# EAGLE design ECE411 V1.06 Final Draft Schematic (EAGLE 9.6.2)
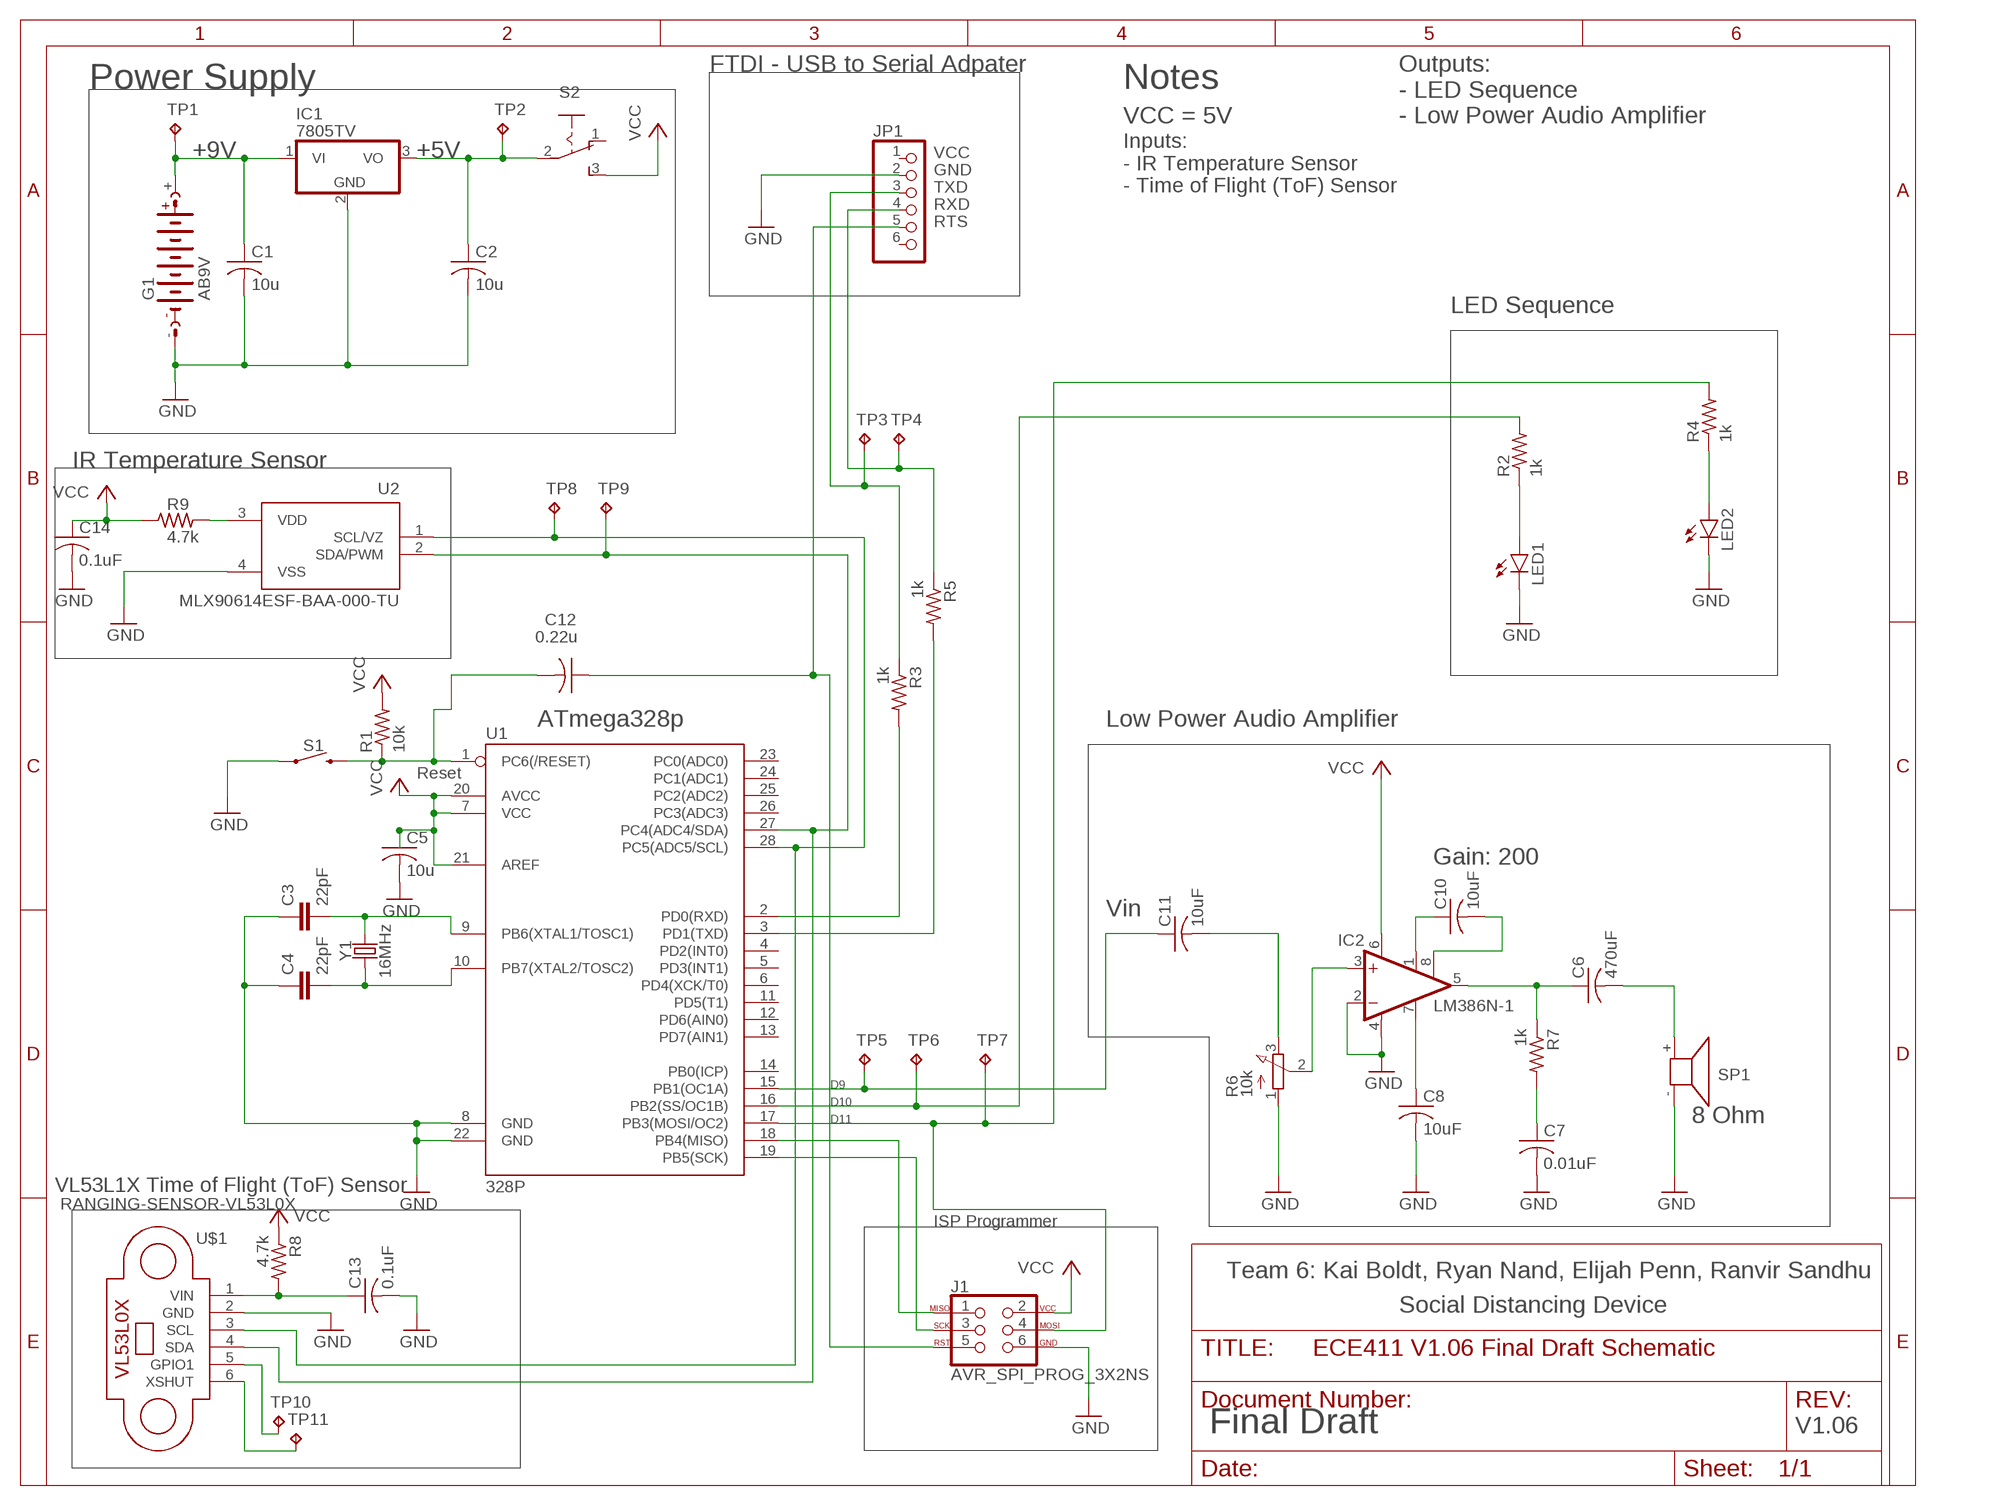
[diagram p0: schematic, sheet 1]

## Parts
C1  10u  C-US025-024X044  [C025-024X044]
C2  10u  C-US025-024X044  [C025-024X044]
C3  22pF  22PF-PTH-2.54MM-200V-5%  [CAP-PTH-2.54]
C4  22pF  22PF-PTH-2.54MM-200V-5%  [CAP-PTH-2.54]
C5  10u  C-US025-024X044  [C025-024X044]
C6  470uF  C-US050-024X044  [C050-024X044]
C7  0.01uF  C-US025-024X044  [C025-024X044]
C8  10uF  C-US025-024X044  [C025-024X044]
C10  10uF  C-US025-024X044  [C025-024X044]
C11  10uF  C-US025-024X044  [C025-024X044]
C12  0.22u  C-US050-030X075  [C050-030X075]
C13  0.1uF  C-US025-024X044  [C025-024X044]
C14  0.1uF  C-US025-024X044  [C025-024X044]
G1  AB9V  [AB9V]
IC1  7805TV  [TO220V]
IC2  LM386N-1  [DIL08]
J1  AVR_SPI_PROG_3X2NS  [2X3-NS]
JP1  PINHD-1X6  [1X06]
LED1  LED3MM  [LED3MM]
LED2  LED3MM  [LED3MM]
R1  10k  R-US_0204/7  [0204/7]
R2  1k  R-US_0204/5  [0204/5]
R3  1k  R-US_0204/7  [0204/7]
R4  1k  R-US_0204/5  [0204/5]
R5  1k  R-US_0204/7  [0204/7]
R6  10k  3RP/1610N  [3RP/1610N]
R7  1k  R-US_0204/7  [0204/7]
R8  4.7k  R-US_0204/7  [0204/7]
R9  4.7k  R-US_0204/7  [0204/7]
S1  MOMENTARY-SWITCH-SPST-PTH-6.0MM  [TACTILE_SWITCH_PTH_6.0MM]
S2  255SB  [255SB]
SP1  KSS1201  [KSS1201]
TP1  TPPAD1-13  [P1-13]
TP2  TPPAD1-13  [P1-13]
TP3  TPPAD1-13  [P1-13]
TP4  TPPAD1-13  [P1-13]
TP5  TPPAD1-13  [P1-13]
TP6  TPPAD1-13  [P1-13]
TP7  TPPAD1-13  [P1-13]
TP8  TPPAD1-13  [P1-13]
TP9  TPPAD1-13  [P1-13]
TP10  TPPAD1-13  [P1-13]
TP11  TPPAD1-13  [P1-13]
U1  328P  ATMEGA328P_PDIP  [DIP28]
U2  MLX90614ESF-BAA-000-TU  [TO254P942H425-4]
U$1  RANGING-SENSOR-VL53L0X  [RANGING-SENSOR-VL53L0X]
Y1  16MHz  CRYSTAL-16MHZPTH-HC49US  [HC49US]

## Nets
5V: C2.1 IC1.3(VO) S2.2(P) TP2.TP
+9V: C1.1 G1.+ IC1.1(VI) TP1.TP
AUDIO: C11.1 TP5.TP U1.15(PB1(OC1A))
BYPASS: C8.1 IC2.7(BYPASS)
GAIN: C10.1 IC2.1(GAIN)
GND: C1.2 C2.2 C3.1 C4.1 C5.2 C7.2 C8.2 C13.2 C14.2 G1.- IC1.2(GND) IC2.2(-IN) IC2.4(GND) J1.6 JP1.2 LED1.K(C) LED2.K(C) R6.1(A) S1.1 SP1.- U1.8(GND) U1.22(GND) U2.4(VSS) U$1.2(GND)
GPIO1: TP10.TP U$1.5(GPIO1)
INPUT: IC2.3(+IN) R6.2(S)
LED1: R2.2 TP6.TP U1.16(PB2(SS/OC1B))
LED2: J1.4 R4.2 TP7.TP U1.17(PB3(MOSI/OC2))
N$1: C3.2 U1.9(PB6(XTAL1/TOSC1)) Y1.2
N$2: J1.1 U1.18(PB4(MISO))
N$3: C4.2 U1.10(PB7(XTAL2/TOSC2)) Y1.1
N$6: J1.3 U1.19(PB5(SCK))
N$7: C7.1 R7.2
N$10: C10.2 IC2.8(GAIN)
N$13: C11.2 R6.3(E)
N$21: LED1.A R2.1
N$22: LED2.A R4.1
RESET: C12.2 R1.1 S1.3 U1.1(PC6(/RESET))
RTS: C12.1 J1.5 JP1.5
RXD: JP1.4 R5.1 R5.2 TP4.TP U1.3(PD1(TXD))
SCL: TP8.TP U1.28(PC5(ADC5/SCL)) U2.1(SCL/VZ) U$1.3(SCL)
SDA: TP9.TP U1.27(PC4(ADC4/SDA)) U2.2(SDA/PWM) U$1.4(SDA)
TXD: JP1.3 R3.1 R3.2 TP3.TP U1.2(PD0(RXD))
VCC: C5.1 C13.1 C14.1 IC2.6(VS) J1.2 R1.2 R8.1 R8.2 R9.1 R9.2 S2.3(S) U1.7(VCC) U1.20(AVCC) U1.21(AREF) U2.3(VDD) U$1.1(VIN)
VO: C6.2 SP1.+
VOUT: C6.1 IC2.5(OUT) R7.1
XSHUT: TP11.TP U$1.6(XSHUT)
Unconnected: JP1.1 JP1.6 S2.1(O) U1.4(PD2(INT0)) U1.5(PD3(INT1)) U1.6(PD4(XCK/T0)) U1.11(PD5(T1)) U1.12(PD6(AIN0)) U1.13(PD7(AIN1)) U1.14(PB0(ICP)) U1.23(PC0(ADC0)) U1.24(PC1(ADC1)) U1.25(PC2(ADC2)) U1.26(PC3(ADC3))

## Notes on the sheet
- FTDI - USB to Serial Adpater
- Power Supply | Notes
- VCC = 5V
- Outputs:
  - LED Sequence
  - Low Power Audio Amplifier
- +5V | VCC
- GND
- TXD
- Inputs:
  - IR Temperature Sensor
  - Time of Flight (ToF) Sensor
- RXD
- RTS
- LED Sequence
- IR Temperature Sensor
- ATmega328p | Low Power Audio Amplifier
- Reset
- Gain: 200
- Vin
- D9
- D10
- D11 | 8 Ohm
- VL53L1X Time of Flight (ToF) Sensor
- ISP Programmer
- Team 6: Kai Boldt, Ryan Nand, Elijah Penn, Ranvir Sandhu
- Social Distancing Device
- Final Draft | V1.06

## Library data of the parts
C1 C2 C5-C8 C10-C14 = rcl:C-US: CAPACITOR, American symbol; SPICEPREFIX: C
C3 C4 = SparkFun-Capacitors:22PF: 22pF ceramic capacitors A capacitor is a passive two-terminal electrical component used to store electrical energy temporarily in an electric field.; PROD_ID: CAP-09128
G1 = battery:AB9V: 9-V BATTERY CLIP
IC1 = linear:78*: Positive VOLTAGE REGULATOR Source: http://cache.national.com/ds/LM/LM78L05.pdf http://www.fairchildsemi.com/ds/LM/LM7805.pdf
IC2 = linear:LM386?-*: Low Voltage Audio Power Amplifier Source: http://cache.national.com/ds/LM/LM386.pdf
J1 = SparkFun-Connectors:AVR_SPI_PROG_3X2: AVR ISP 6 Pin This is the reduced ISP connector for AVR programming. Common on Arduino. This footprint will take up less PCB space and can be used with a 10-pin to 6-pin adapter such as SKU: BOB-08508 **Special note about "TEST_POINT" package. The stop mask is on the top side, so if you want your programming test points to be on the bottom of your board, make sure to place this package on the bottom side of the board. This also ensure that the orientation to program from the bottom side will be correct. SparkFun Products: SparkFun ISP Pogo Adapter <https://www.sparkfun.com/products/11591> - NS Tiny AVR Programmer <https://www.sparkfun.com/products/11801> -PTH
JP1 = pinhead:PINHD-1X6: PIN HEADER
LED1 LED2 = led:LED: LED OSRAM: - CHIPLED LG R971, LG N971, LY N971, LG Q971, LY Q971, LO R971, LY R971 LH N974, LH R974 LS Q976, LO Q976, LY Q976 LO Q996 - Hyper CHIPLED LW Q18S LB Q993, LB Q99A, LB R99A - SideLED LS A670, LO A670, LY A670, LG A670, LP A670 LB A673, LV A673, LT A673, LW A673 LH A674 LY A675 LS A676, LA A676, LO A676, LY A676, LW A676 LS A679, LY A679, LG A679 - Hyper Micro SIDELED® LS Y876, LA Y876, LO Y876, LY Y876 LT Y87S - SmartLED LW L88C, LW L88S LB L89C, LB L89S, LG L890 LS L89K, LO L89K, LY L89K LS L896, LA L896, LO L896, LY L896 - TOPLED LS T670, LO T670, LY T670, LG T670, LP T670 LSG T670, LSP T670, LSY T670, LOP T670, LYG T670 LG T671, LOG T671, LSG T671 LB T673, LV T673, LT T673, LW T673 LH T674 LS T676, LA T676, LO T676, LY T676, LB T676, LH T676, LSB T676, LW T676 LB T67C, LV T67C, LT T67C, LS T67K, LO T67K, LY T67K, LW E67C LS E67B, LA E67B, LO E67B, LY E67B, LB E67C, LV E67C, LT E67C LW T67C LS T679, LY T679, LG T679 LS T770, LO T770, LY T770, LG T770, LP T770 LB T773, LV T773, LT T773, LW T773 LH T774 LS E675, LA E675, LY E675, LS T675 LS T776, LA T776, LO T776, LY T776, LB T776 LHGB T686 LT T68C, LB T68C - Hyper Mini TOPLED® LB M676 - Mini TOPLED Santana® LG M470 LS M47K, LO M47K, LY M47K Source: http://www.osram.convergy.de LUXEON: - LUMILED® LXK2-PW12-R00, LXK2-PW12-S00, LXK2-PW14-U00, LXK2-PW14-V00 LXK2-PM12-R00, LXK2-PM12-S00, LXK2-PM14-U00 LXK2-PE12-Q00, LXK2-PE12-R00, LXK2-PE12-S00, LXK2-PE14-T00, LXK2-PE14-U00 LXK2-PB12-K00, LXK2-PB12-L00, LXK2-PB12-M00, LXK2-PB14-N00, LXK2-PB14-P00, LXK2-PB14-Q00 LXK2-PR12-L00, LXK2-PR12-M00, LXK2-PR14-Q00, LXK2-PR14-R00 LXK2-PD12-Q00, LXK2-PD12-R00, LXK2-PD12-S00 LXK2-PH12-R00, LXK2-PH12-S00 LXK2-PL12-P00, LXK2-PL12-Q00, LXK2-PL12-R00 Source: www.luxeon.com KINGBRIGHT: KA-3528ASYC Source: www.kingbright.com
R1-R5 R7-R9 = rcl:R-US_: RESISTOR, American symbol; SPICEPREFIX: R
R6 = pot:3RP/1610N: 16mm Potentiometer one level Source: http://www.alphapotentiometers.net/html/16mm_pot_2.html
S1 = SparkFun-Switches:MOMENTARY-SWITCH-SPST: Momentary Switch (Pushbutton) - SPST Normally-open (NO) SPST momentary switches (buttons, pushbuttons). Variants PTH-12MM - 12mm square, through-hole Momentary Pushbutton Switch - 12mm Square <https://www.sparkfun.com/products/9190> (COM-09190) PTH-6.0MM, PTH-6.0MM-KIT - 6.0mm square, through-hole Mini Pushbutton Switch <https://www.sparkfun.com/products/97> (COM-00097) KIT package intended for soldering kit's - only one side of pads' copper is exposed. PTH-RIGHT-ANGLE-KIT - Right-angle, through-hole Right Angle Tactile Button <https://www.sparkfun.com/products/10791> - Used on SparkFun BigTime Watch Kit <https://www.sparkfun.com/products/11734> SMD-12MM - 12mm square, surface-mount Tactile Button - SMD (12mm) <https://www.sparkfun.com/products/12993> (COM-12993) Used on SparkFun PicoBoard <https://www.sparkfun.com/products/11888> SMD-4.5MM - 4.5mm Square Trackball Switch Used on SparkFun Blackberry Trackballer Breakout <https://www.sparkfun.com/products/13169> SMD-4.6MMX2.8MM - 4.60mm x 2.80mm, surface mount Used on SparkFun SAMD21 Mini Breakout <https://www.sparkfun.com/products/13664> SMD-5.2MM, SMD-5.2-REDUNDANT - 5.2mm square, surface-mount Mini Pushbutton Switch - SMD <https://www.sparkfun.com/products/8720> (COM-08720) Used on Arduino Pro Mini <https://www.sparkfun.com/products/11114> REDUNDANT package connects both switch circuits together SMD-6.0X3.5MM - 6.0 x 3.5mm, surface mount Momentary Reset Switch SMD <https://www.sparkfun.com/products/8229> (COM-08229) SMD-6.2MM-TALL - 6.2mm square, surface mount Tactile Button - SMD (6mm) <https://www.sparkfun.com/products/12992> Used on SparkFun Digital Sandbox <https://www.sparkfun.com/products/12651> SMD-RIGHT-ANGLE - Right-angle, surface mount Used on SparkFun Block for Intel® Edison - Arduino <https://www.sparkfun.com/products/13036>; PROD_ID: SWCH-08441; SF_SKU: COM-00097
S2 = switch:255SB: SLIDING SWITCH Distributor Buerklin, 11G810
SP1 = buzzer:KSS1201: SPEAKER Source: Schukat; OC_FARNELL: unknown; OC_NEWARK: unknown
TP1-TP11 = testpad:TP: Test pad
U1 = SparkFun-IC-Microcontroller:ATMEGA328P_PDIP: Atmel 328P Through hole ATMEGA328P uC used in the Arduino 32kb flash, 1k EEPROM, 2k SRAM Datasheet <http://www.sparkfun.com/datasheets/Components/SMD/ATMega328.pdf> SparkFun Products Storefront component: AVR 28 Pin 20MHz 32K 6A/D - ATMega328P <https://www.sparkfun.com/products/9061> (COM-09061) SparkFun Simon Says - Through-Hole Soldering Kit <https://www.sparkfun.com/products/10547> (KIT-10547) SparkFun Learn to Solder - Simon Says <https://www.sparkfun.com/products/13708> (KIT-13708) SparkFun BigTime Watch Kit <https://www.sparkfun.com/products/11734> (KIT-11734) SparkFun ClockIt <https://www.sparkfun.com/products/10930> (KIT-10930) SparkFun Serial Enabled LCD Kit <https://www.sparkfun.com/products/10097> (LCD-10097) SparkFun Simon Tilts - Through Hole Soldering Kit <https://www.sparkfun.com/products/12634> (KIT-12634) SparkFun Frequency Counter Kit <https://www.sparkfun.com/products/10140> (KIT-10140) FabFM Radio Kit <https://www.sparkfun.com/products/11043> (KIT-11043) SparkFun Binary Blaster Kit <https://www.sparkfun.com/products/12037> (KIT-12037) SparkFun Metro-Gnome <https://www.sparkfun.com/products/9236> (KIT-09236) ATmega328 with Arduino Optiboot (Uno) <https://www.sparkfun.com/products/10524> (DEV-10524); PROD_ID: IC-09136
U2 = MLX90614ESF-BAA-000-TU:MLX90614ESF-BAA-000-TU: Temperature Sensor Digital, Infrared (IR) -40°C ~ 85°C 16 b TO-39 Check prices <https://pricing.snapeda.com/parts/MLX90614ESF-BAA-000-TU/Melexis/view-part?ref=eda>; AVAILABILITY: Warning; DESCRIPTION: Temperature Sensor Digital, Infrared (IR) -40°C ~ 85°C 16 b TO-39; MF: Melexis; MP: MLX90614ESF-BAA-000-TU; PACKAGE: TO-39 Melexis; PRICE: None; PURCHASE-URL: https://pricing.snapeda.com/search/part/MLX90614ESF-BAA-000-TU/?ref=eda
U$1 = VL53L0X:RANGING-SENSOR-VL53L0X: Laser Ranging Sensor based on VL53L0X device More information about VL53L0X device can be found here: http://www.st.com/en/imaging-and-photonics-solutions/vl53l0x.html Arduino Library for VL53L0X is available here: https://github.com/pololu/vl53l0x-arduino Click here to find device on ebay.com <http://www.ebay.com/sch/GY+VL53L0X+module> Note: There are many variants. Search for the proper version.
Y1 = SparkFun-Clocks:CRYSTAL-16MHZ: 16MHz Crystal Digikey Example <http://www.digikey.com/product-search/en?keywords=535-9122-1-ND> Frequency: 16MHz Frequency Stability: ±50ppm Frequency Tolerance: ±20ppm Load Capacitance: 18pF SparkFun Products: Pro Micro -5V/16MHz <https://www.sparkfun.com/products/12640> SparkFun Serial Enabled LCD Kit <https://www.sparkfun.com/products/10097>; PROD_ID: XTAL-08181; SF_ID: COM-00536

## Board
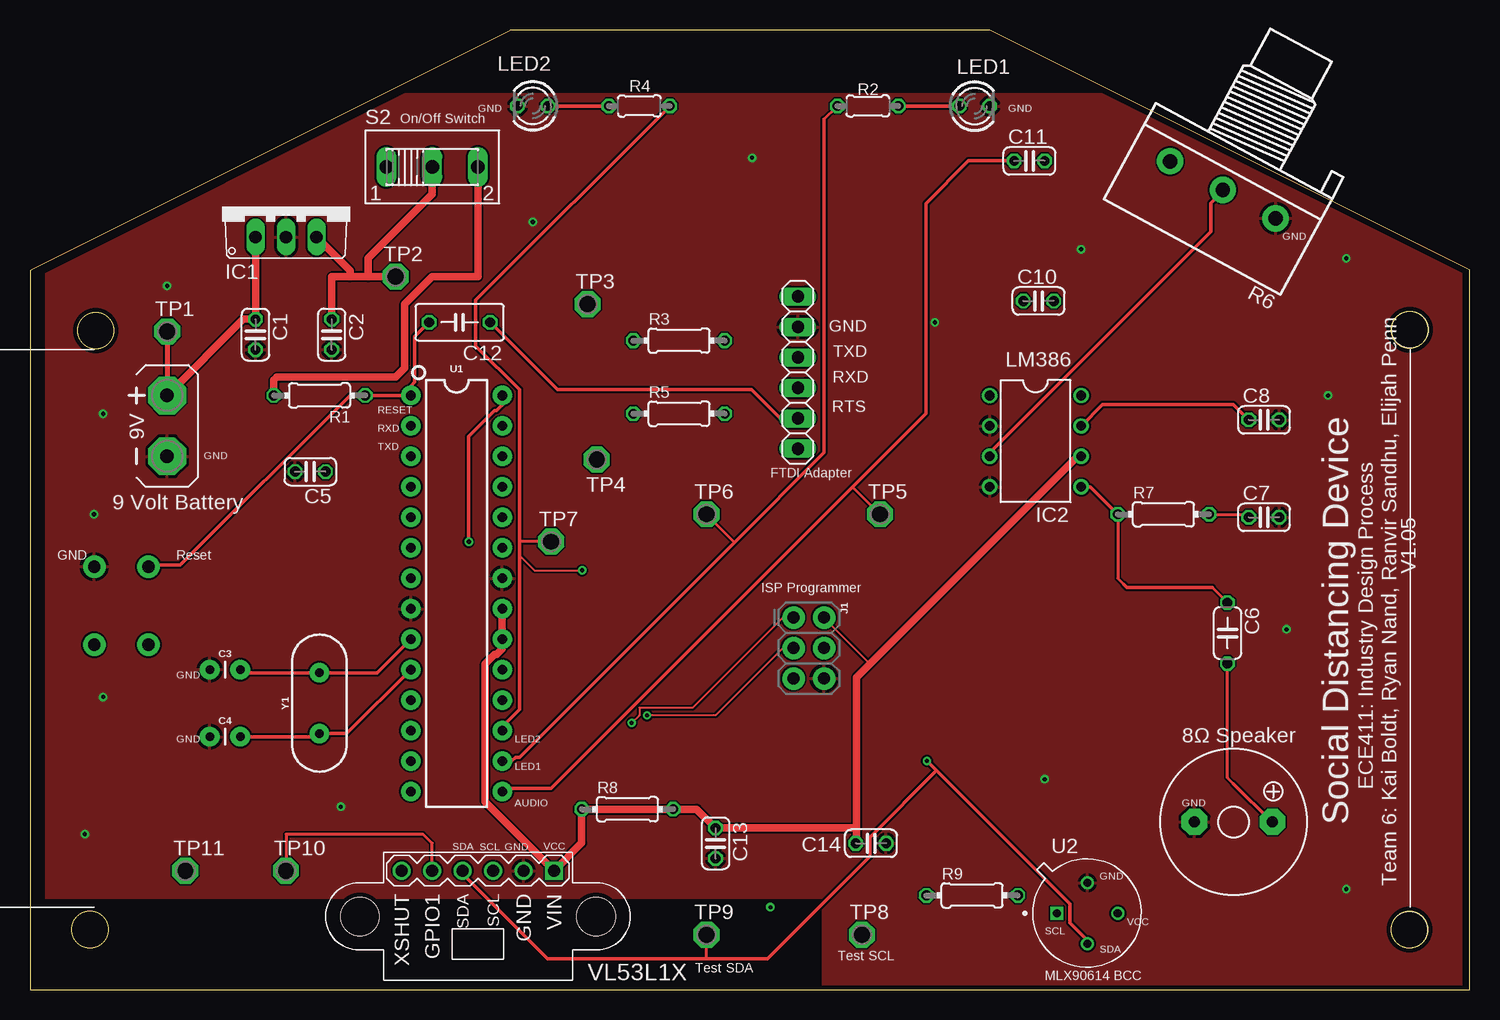
[diagram p1: board, top side]
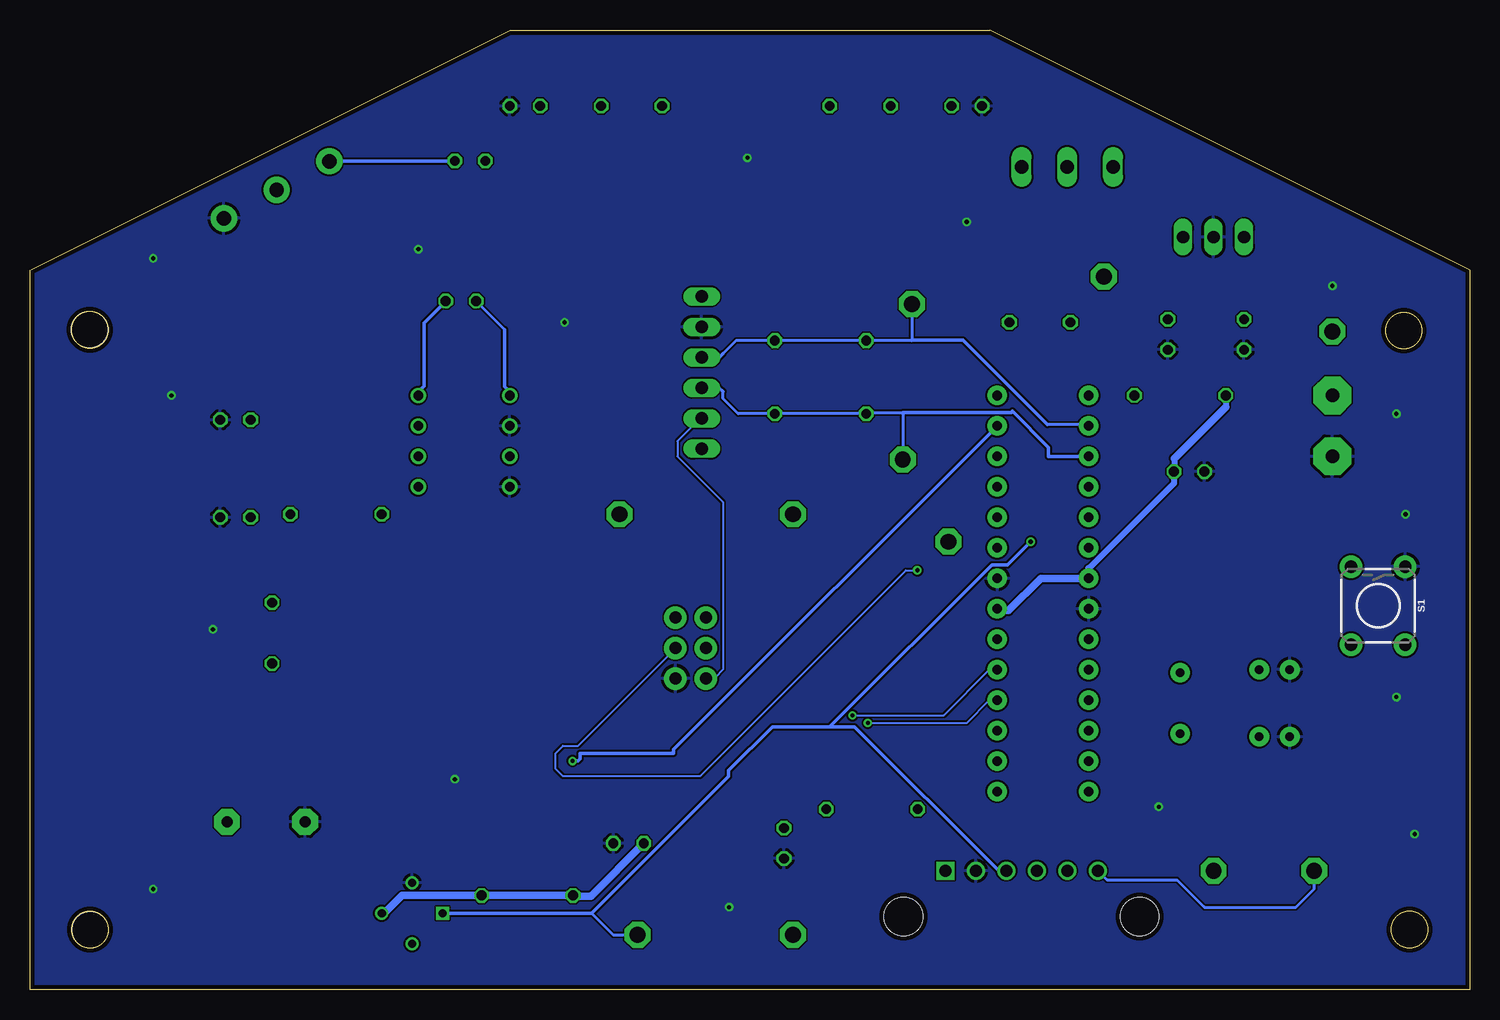
[diagram p2: board, bottom side, seen from below]

Size 120 x 80 mm. Coordinates in mm from the lower left corner, seen from the top.
Outline: 0,60 0,0 120,0 120,60 80,80 40,80 0,60
Outline: circle at 115,55 radius 1.5
Outline: circle at 5.48,54.95 radius 1.5
Outline: circle at 115,5 radius 1.5
Outline: circle at 5,5 radius 1.5
Copper layers (1*16): Top 0.0356mm / dielectric 1.5011mm / Bottom 0.0356mm
Design rules "default *": minimum track width 6mil, minimum drill 13mil, track to track 6mil, track to pad 6mil, pad to pad 6mil, via to via 6mil, smd to smd 6mil, copper to edge 15mil, drill to drill 6mil, minimum pad ring 7mil, minimum via ring 7mil, stop-mask expansion 3mil, vias tented up to drill 0mil, thermal gap 10mil
Holes 3 mm at 5.49,54.94 5,5 114.99,4.98 115.04,55.02

### Footprints (pad centres in the part's own frame; a part is rotated, then mirrored left to right if it is on the bottom)
C025-024X044 = drill 0.813 octagon: 1 -1.27,0; 2 1.27,0
CAP-PTH-2.54 = drill 0.7 pad 1.651: 1 -1.27,0; 2 1.27,0
C050-024X044 = drill 0.813 octagon: 1 -2.54,0; 2 2.54,0
C050-030X075 = drill 0.813 octagon: 1 -2.54,0; 2 2.54,0
AB9V = drill 1.118 pad 3.15 octagon: + 0,2.54; - 0,-2.54
TO220V = drill 1.016 long: 1 -2.54,-2.54; 2 0,-2.54; 3 2.54,-2.54
DIL08 = drill 0.813 pad 1.27: 1 -3.81,-3.81; 2 -1.27,-3.81; 3 1.27,-3.81; 4 3.81,-3.81; 5 3.81,3.81; 6 1.27,3.81; 7 -1.27,3.81; 8 -3.81,3.81
2X3-NS = drill 1.016 pad 1.88: 1 -2.54,-1.27; 2 -2.54,1.27; 3 0,-1.27; 4 0,1.27; 5 2.54,-1.27; 6 2.54,1.27
1X06 = drill 1.016 long: 1 -6.35,0; 2 -3.81,0; 3 -1.27,0; 4 1.27,0; 5 3.81,0; 6 6.35,0
LED3MM = drill 0.813 octagon: A -1.27,0; K 1.27,0
0204/7 = drill 0.813 octagon: 1 -3.81,0; 2 3.81,0
0204/5 = drill 0.813 octagon: 1 -2.54,0; 2 2.54,0
3RP/1610N = drill 1.2 pad 2.184: 1 -5,0; 2 0,0; 3 5,0
TACTILE_SWITCH_PTH_6.0MM = drill 1.016 pad 1.88: 1 -3.251,2.261; 2 3.251,2.261; 3 -3.251,-2.261; 4 3.251,-2.261
255SB = drill 1.118 long: 1 -3.81,0; 2 0,0; 3 3.81,0
KSS1201 = drill 0.914 pad 2.159 octagon: + 3.251,0; - -3.251,0
P1-13 = drill 1.321 pad 2.159 octagon: TP 0,0
DIP28 = drill 0.813 pad 1.626: 1 -16.51,-3.81; 2 -13.97,-3.81; 3 -11.43,-3.81; 4 -8.89,-3.81; 5 -6.35,-3.81; 6 -3.81,-3.81; 7 -1.27,-3.81; 8 1.27,-3.81; 9 3.81,-3.81; 10 6.35,-3.81; 11 8.89,-3.81; 12 11.43,-3.81; 13 13.97,-3.81; 14 16.51,-3.81; 15 16.51,3.81; 16 13.97,3.81; 17 11.43,3.81; 18 8.89,3.81; 19 6.35,3.81; 20 3.81,3.81; 21 1.27,3.81; 22 -1.27,3.81; 23 -3.81,3.81; 24 -6.35,3.81; 25 -8.89,3.81; 26 -11.43,3.81; 27 -13.97,3.81; 28 -16.51,3.81
TO254P942H425-4 = drill 0.69 pad 1.09 square: 1 -2.54,0 | drill 0.69 pad 1.09: 2 0,-2.54; 3 2.54,0; 4 0,2.54
RANGING-SENSOR-VL53L0X = drill 1 square: 1 -3.81,6.35 | drill 1: 2 -3.81,3.81; 3 -3.81,1.27; 4 -3.81,-1.27; 5 -3.81,-3.81; 6 -3.81,-6.35 | hole 3.2: 0,9.85; 0,-9.85
HC49US = drill 0.7 pad 1.651: 1 -2.54,0; 2 2.54,0

### Placement (x,y rotation side)
C1  18.8,54.61 270 top
C2  25.15,54.61 270 top
C3  16.26,26.67 0 top
C4  16.26,21.08 0 top
C5  23.37,43.18 180 top
C6  99.82,29.72 270 top
C7  102.87,39.37 0 top
C8  102.87,47.5 0 top
C10  84.07,57.4 0 top
C11  83.31,69.09 0 top
C12  35.81,55.63 180 top
C13  57.15,12.19 270 top
C14  70.1,12.19 0 top
G1  11.43,46.99 0 top
IC1  21.34,65.28 0 top
IC2  83.82,45.72 270 top
J1  64.92,28.47 270 top
JP1  64.01,51.44 270 top
LED1  78.74,73.66 0 top
LED2  41.91,73.66 180 top
R1  24.13,49.53 180 top
R2  69.85,73.66 180 top
R3  54.1,54.1 0 top
R4  50.8,73.66 0 top
R5  54.1,48.01 0 top
R6  99.44,66.67 151.6 top
R7  94.49,39.62 0 top
R8  49.81,15.04 0 top
R9  78.54,7.85 0 top
S1  7.62,32 270 bottom
S2  33.53,68.58 0 top
SP1  100.33,13.97 0 top
TP1  11.43,54.86 0 top
TP2  30.48,59.44 0 top
TP3  46.48,57.15 0 top
TP4  47.24,44.2 0 top
TP5  70.87,39.62 0 top
TP6  56.39,39.62 0 top
TP7  43.43,37.34 0 top
TP8  69.34,4.57 0 top
TP9  56.39,4.57 0 top
TP10  21.34,9.91 0 top
TP11  12.95,9.91 0 top
U1  35.56,33.02 270 top
U2  88.14,6.35 0 top
U$1  37.34,6.1 270 top
Y1  24.13,23.88 90 top

### Tracks (layer width: path | path; a pad name or v marks a point on that pad's centre or on a via)
5V
  Top 0.61: 26.67,59.44 26.67,59.94 IC1.3 | C2.1 25.15,59.44 26.67,59.44 | TP2.TP 28.19,59.44 | 28.19,59.44 26.67,59.44 | 28.19,59.44 28.19,60.96 33.53,66.29 S2.2
+9V
  Top 0.406: TP1.TP G1.+
  Top 0.61: G1.+ 17.78,55.88 C1.1 IC1.1
AUDIO
  Top 0.2: U1.15 39.62,16.76
  Top 0.254: TP5.TP 68.58,41.91
  Top 0.305: 39.62,16.76 43.43,16.76 68.58,41.91 74.68,48.01 74.68,65.53 78.23,69.09 C11.1
BYPASS
  Top 0.305: IC2.7 89.41,48.77 100.33,48.77 C8.1
GAIN
  Bottom 0.254: 80.42,55.02 C10.1
  Bottom 0.305: IC2.1 80.01,49.85 80.42,50.26 80.42,55.02
GND  (via drill 0.35)
  other vias: 11.43,58.67 6.1,48.01 5.33,39.62 6.1,24.38 4.57,12.95 25.91,15.24 61.72,6.86 84.58,17.53 109.73,8.38 104.75,30.02 108.2,49.53 109.73,60.96 87.63,61.72 60.2,69.34 41.91,64.01 75.44,55.63
  pour Top: 119.38,59.69 89.41,74.68 31.24,74.68 1.27,59.69 1.27,7.62 66.04,7.62 66.04,0 119.38,0
  pour Bottom: 120,0 0,0 0,60 40,80 80,80 120,60
GPIO1
  Top 0.254: U$1.5 33.53,12.19 32.77,12.95 21.34,12.95 TP10.TP
INPUT
  Top 0.152: 80.01,44.77 IC2.3 | 99.54,66.67 R6.2
  Top 0.305: 80.01,44.77 98.42,63.18 98.42,65.56 99.54,66.67
LED1
  Top 0.254: 66.2,72.55 R2.2 | TP6.TP 58.72,37.29
  Top 0.305: 66.2,72.55 66.2,44.77 58.72,37.29 40.8,19.37 40.48,19.37 40.16,19.05 U1.16
LED2  (via drill 0.35)
  Top 0.152: 40.8,36.2 42.04,34.95 v46.02,34.95
  Top 0.254: TP7.TP 40.8,37.34
  Top 0.305: R4.2 37.15,57.47 37.15,53.66 40.8,50.01 40.8,37.34 40.8,36.2 40.8,23.34 39.37,21.91 U1.17
  Bottom 0.152: J1.4 66.67,27.94 74.3,20.32 75.56,20.32 76.2,19.68 76.2,18.41 75.59,17.8 75.56,17.78 64.16,17.78 46.99,34.95 v46.02,34.95
N$1
  Top 0.305: U1.9 28.96,26.42 Y1.2 17.78,26.42 C3.2
N$2  (via drill 0.33)
  Top 0.152: v50.16,22.23 50.8,22.86 50.8,23.5 55.24,23.5 62.87,31.11 63.5,31.11 J1.1
  Bottom 0.152: U1.18 40.01,24.13 41.91,22.23 v50.16,22.23
N$3
  Top 0.305: U1.10 26.42,21.34 Y1.1 23.88,21.08 C4.2
N$6  (via drill 0.33)
  Top 0.152: v51.44,22.86 57.15,22.86 62.87,28.57 63.5,28.57 J1.3
  Bottom 0.152: U1.19 40.01,26.67 43.81,22.86 v51.44,22.86
N$7
  Top 0.2: 101.35,39.62 C7.1
  Top 0.254: R7.2 101.35,39.62
N$10
  Bottom 0.152: 85.41,57.31 C10.2
  Bottom 0.305: IC2.8 87.63,49.85 87.15,50.32 87.15,55.56 85.41,57.31
N$13
  Bottom 0.152: 84.61,69.06 C11.2 | 94.93,69.06 R6.3
  Bottom 0.305: 94.93,69.06 84.61,69.06
N$21
  Top 0.305: R2.1 LED1.A
N$22
  Top 0.305: LED2.A R4.1
RESET
  Top 0.152: 33.18,55.56 C12.2
  Top 0.305: 33.18,55.56 32.07,54.45 32.07,50.64 31.75,50.32 U1.1 R1.1 26.67,49.53 12.54,35.4 10.03,35.4 S1.3
RTS
  Top 0.305: C12.1 43.97,50.01 60.17,50.01 62.55,47.62 JP1.5
  Bottom 0.152: JP1.5 64.77,47.62 64.77,46.99 66.04,45.72 66.04,44.45 62.23,40.64 62.23,26.67 62.87,26.04 63.5,26.04 J1.5
RXD
  Bottom 0.254: TP4.TP 47.24,48.12 50.18,48.12 R5.1 R5.2 60.96,48.01 62.23,49.28 62.23,49.85
  Bottom 0.305: U1.3 35.08,44.45 35.08,45.19 38.1,48.21 38.19,48.12 47.24,48.12 | 62.23,49.85 62.55,50.16 JP1.4
SCL  (via drill 0.35)
  Top 0.305: U1.28 39.37,48.74 38.89,48.26 38.73,48.26 36.58,46.1 v36.58,37.34
  Bottom 0.152: 39.37,10 38.73,10 U$1.3
  Bottom 0.254: 73.18,6.35 71.41,4.57 TP8.TP
  Bottom 0.305: U2.1 73.18,6.35 61.75,17.78 61.75,18.26 58.11,21.9 53.34,21.9 | v36.58,37.34 38.51,35.41 39.83,35.41 53.34,21.9 | 53.34,21.9 51.27,21.9 39.37,10
SDA  (via drill 0.33)
  Top 0.152: 88.11,4.13 88.11,3.81
  Top 0.254: 56.39,2.57 TP9.TP
  Top 0.305: 88.11,4.13 86.68,5.56 86.68,7.14 75.56,18.26 | 75.56,18.26 v74.77,19.05 | 88.11,3.81 U2.2 | 75.56,18.26 70.01,12.7 70.01,11.11 61.47,2.57 56.39,2.57 43.15,2.57 36.2,9.53 36.2,9.84 U$1.4
  Bottom 0.305: U1.27 66.36,20 66.36,19.68 74.14,19.68 74.14,19.21 74.3,19.05 v74.77,19.05
TXD
  Bottom 0.254: TP3.TP 46.48,54.13 46.51,54.1 R3.1 R3.2 61.15,54.1 62.23,53.02 | 35.2,47.1 31.86,47.1 U1.2
  Bottom 0.305: 62.23,53.02 62.55,52.7 JP1.3 | 46.48,54.13 42.23,54.13 35.2,47.1
VCC
  Top 0.152: 38.73,27.94 38.89,27.94 | 70.01,27.15 66.67,30.48 J1.2
  Top 0.508: 20.32,50.8 20.57,51.05
  Top 0.61: 20.32,50.8 R1.2 | IC2.6 87.31,44.45 70.01,27.15 68.9,26.04 68.9,13.49 | 68.9,13.49 59.13,13.49 59.1,13.46 C13.1 55.58,15.04 R8.2 R8.1 46,12.22 U$1.1 37.94,15.65 37.94,27.15 38.73,27.94 | 38.89,27.94 39.37,28.42 U1.20 U1.21 | S2.3 37.34,59.44 33.53,59.44 31.24,57.15 31.24,51.82 30.48,51.05 20.57,51.05 | 68.9,13.49 68.9,12.26 C14.1
  Bottom 0.152: 24.61,43.18 C5.1
  Bottom 0.508: 24.61,44.29 24.61,43.18 24.61,42.23 31.75,35.08 | R1.2 20.32,48.58
  Bottom 0.61: 20.32,48.58 24.61,44.29 | 31.75,35.08 U1.7 35.72,34.29 38.42,31.59 39.21,31.59 U1.21 | U2.3 90.49,6.35 88.99,7.85 R9.2 R9.1 74.66,7.78 73.25,7.78 C14.1 68.83,12.13
VO
  Top 0.152: 103.5,13.97 SP1.+
  Top 0.254: 100.33,17.14 99.82,17.65 C6.2
  Top 0.305: 103.5,13.97 100.33,17.14
VOUT
  Top 0.254: 98.55,33.53 C6.1 | R7.1 90.68,34.29 91.19,33.78
  Top 0.305: IC2.5 88.39,41.91 R7.1 | 98.55,33.53 91.44,33.53 91.19,33.78
XSHUT
  Bottom 0.254: U$1.6 30.23,9.14 24.38,9.14 22.1,6.86 14.48,6.86 12.95,8.38 TP11.TP

### Text on the board
tPlace: GND | GND | On/Off Switch | GND | GND | LM386 | RESET | RXD | TXD | GND | FTDI Adapter | 9 Volt Battery | GND | Reset | V1.05 | ISP Programmer | GND | GND | LED2 | 8Ω Speaker | LED1 | ECE411: Industry Design Process | AUDIO | GND | Social Distancing Device | GND | Team 6: Kai Boldt, Ryan Nand, Ranvir Sandhu, Elijah Penn | SCL | VCC | SDA | Test SCL | Test SDA
tNames: TXD | RXD | RTS | SDA | SCL | GND | VCC | VL53L1X | MLX90614 BCC